# Altium project PCB_PROYECTO_2024.PrjPcb
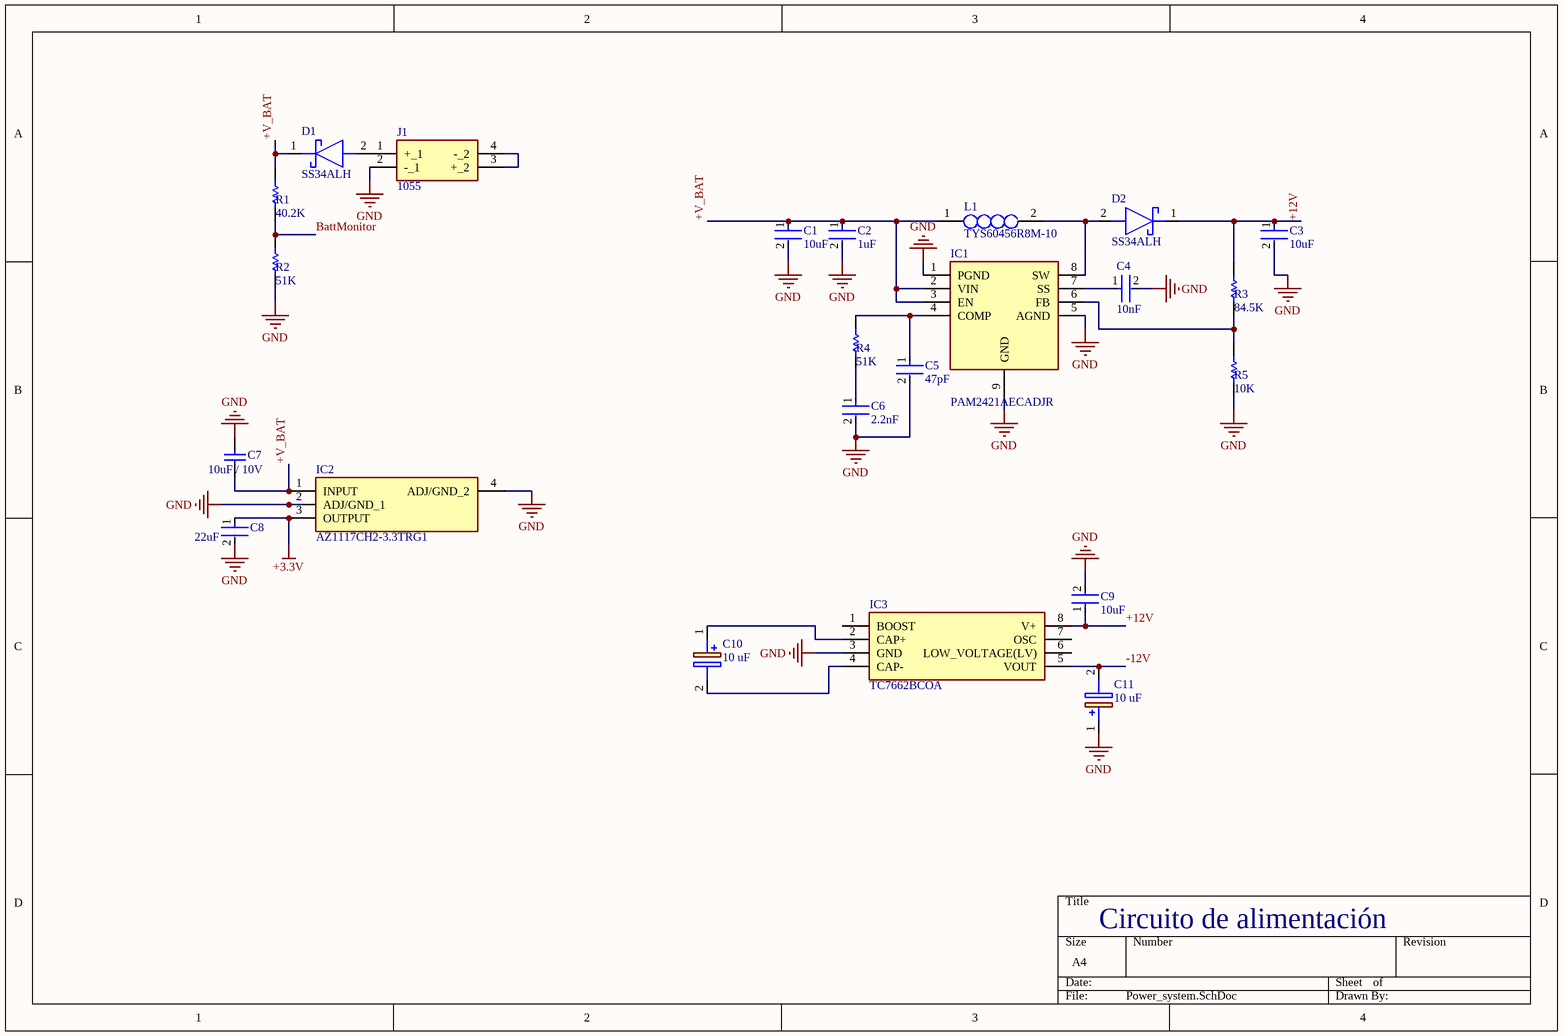
[diagram p0: Power_system.SchDoc]
3 sheets, 48 parts. Net scope: global (net labels, ports and power ports of the same name join across sheets).
Board file: PCB1.PcbDoc
Sheets:
  Power_system.SchDoc
  ESP32_SENSORS.SchDoc
  Signal_conditioning.SchDoc

## Sheet Power_system.SchDoc
size A4; SheetNumber: 1; SheetTotal: 3

### Parts
C1  10uF  [FP-GRM188-0_2-MFG]
C2  1uF  [FP-GRM188-0_2-MFG]
C3  10uF  [FP-GRM188-0_2-MFG]
C4  10nF  [FP-GRM188-0_2-MFG]
C5  47pF  [FP-GRM188-0_2-MFG]
C6  2.2nF  [FP-GRM188-0_2-MFG]
C7  10uF / 10V  [CAPC1608X90X35LL15T15]
C8  22uF  [FP-GRM188-0_2-MFG]
C9  10uF  [FP-GRM188-0_2-MFG]
C10  10 uF  [CAPAE430X550N]
C11  10 uF  [CAPAE430X550N]
D1  SS34ALH  [SODFL5226X100N]
D2  SS34ALH  [SODFL5226X100N]
IC1  PAM2421AECADJR  [SOIC127P600X150-9N]
IC2  AZ1117CH2-3.3TRG1  [SOT230P700X180-4N]
IC3  TC7662BCOA  [SOIC127P600X175-8N]
J1  1055  [1055]
L1  TYS60456R8M-10  [INDPM6060X470N]
R1  40.2K  [RESC1608X55X30ML20T20]
R2  51K  [RESC1608X55X30ML20T20]
R3  84.5K  [RESC1608X55X30ML20T20]
R4  51K  [RESC1608X55X30ML20T20]
R5  10K  [RESC1608X55X30ML20T20]

### Nets
+3.3V: C8.1 IC2.3(OUTPUT)
GND: C1.2 C2.2 C3.2 C4.2 C5.2 C6.2 C7.1 C8.2 C9.2 C11.1(+) IC1.1(PGND) IC1.5(AGND) IC1.9(GND) IC2.2(ADJ/GND_1) IC2.4(ADJ/GND_2) IC3.3(GND) J1.2(-_1) R2.1 R5.1
+12V: C3.1 C9.1 D2.1(K) IC3.8(V+) R3.2
+V_BAT: C1.1 C2.1 C7.2 D1.1(K) IC1.2(VIN) IC1.3(EN) IC2.1(INPUT) L1.1 R1.2
-12V: C11.2(-) IC3.5(VOUT)
BattMonitor: R1.1 R2.2
NetC4_1: C4.1 IC1.7(SS)
NetC5_1: C5.1 IC1.4(COMP) R4.2
NetC6_1: C6.1 R4.1
NetC10_1: C10.1(+) IC3.2(CAP+)
NetC10_2: C10.2(-) IC3.4(CAP-)
NetD1_2: D1.2(A) J1.1(+_1)
NetD2_2: D2.2(A) IC1.8(SW) L1.2
NetIC1_6: IC1.6(FB) R3.1 R5.2
NetJ1_3: J1.3(+_2) J1.4(-_2)

Not connected (* = marked no-connect by the designer): IC3 1(BOOST) 6(LOW_VOLTAGE(LV)) 7(OSC)

### Notes on the sheet
- Circuito de alimentación

### Library data of the parts
C1-C6 C8 C9 = CMP-2006-02788-2: Chip Multilayer Ceramic Capacitors for General Purpose, 0603, 22uF, X5R, 15%, 20%, 4V; Case/Package: 0603; Package Quantity: 4000; Lead Free: Lead Free; Material: Ceramic; Height: 0.8mm; Length: 1.6mm; REACH SVHC: No SVHC; Voltage Rating: 4V; Depth: 0.8mm; Case Code (Metric): 1608; Voltage: 4V; Dielectric: X5R; Width: 0.8mm; Max Operating Temperature: 85°C; Tolerance: 20%; Packaging: Tape and Reel; Case Code (Imperial): 0603; Voltage Rating (DC): 4V; Thickness: 0.035inch; Mount: Surface Mount; Min Operating Temperature: -55°C; Radiation Hardening: No; Capacitance: 22uF; Termination: SMD/SMT
C7 = CMP-2006-02241-1: Part Number: C0603C105K9PACTU; Manufacturer: Kemet
C10 C11 = 865080340001: Capacitor Polarised; Manufacturer_Name: Wurth Elektronik; Datasheet Link: https://componentsearchengine.com/Datasheets/1/865080340001.pdf; Height: 5.5mm; Manufacturer_Part_Number: 865080340001; Mouser Part Number: 710-865080340001; Mouser Price/Stock: https://www.mouser.co.uk/ProductDetail/Wurth-Elektronik/865080340001?qs=0KOYDY2FL2%252BaqRFD837lAw%3D%3D
D1 D2 = SS34ALH: Schottky Diode; Manufacturer_Name: Taiwan Semiconductor; Datasheet Link: https://services.ts.com.tw/storage/resources/datasheet/SS34ALH%20SERIES_B2103.pdf; Height: 1mm; Manufacturer_Part_Number: SS34ALH; Mouser Part Number: 821-SS34ALH; Mouser Price/Stock: https://www.mouser.co.uk/ProductDetail/Taiwan-Semiconductor/SS34ALH?qs=A6eO%252BMLsxmQip%2FrgNup6RA%3D%3D; Arrow Part Number: SS34ALH; Arrow Price/Stock: https://www.arrow.com/en/products/ss34alh/taiwan-semiconductor?region=nac
IC1 = PAM2421AECADJR: Integrated Circuit; Manufacturer_Name: Diodes Incorporated; Datasheet Link: https://www.diodes.com/assets/Datasheets/products_inactive_data/PAM2421_22_23.pdf; Height: 1.5mm; Manufacturer_Part_Number: PAM2421AECADJR; Mouser Part Number: 621-PAM2421AECADJR; Mouser Price/Stock: https://www.mouser.co.uk/ProductDetail/Diodes-Incorporated/PAM2421AECADJR?qs=pYVYkI7xuRVOhRU6vAk7Ag%3D%3D; Arrow Part Number: PAM2421AECADJR; Arrow Price/Stock: https://www.arrow.com/en/products/pam2421aecadjr/diodes-incorporated?region=nac
IC2 = AZ1117CH2-3.3TRG1: Integrated Circuit; Manufacturer_Name: Diodes Incorporated; Datasheet Link: https://www.arrow.com/en/products/az1117ch2-3.3trg1/diodes-incorporated; Height: 1.8mm; Manufacturer_Part_Number: AZ1117CH2-3.3TRG1; Mouser Part Number: 621-AZ1117CH2-33TRG1; Mouser Price/Stock: https://www.mouser.co.uk/ProductDetail/Diodes-Incorporated/AZ1117CH2-3.3TRG1?qs=lQAVKuKFhkLc7jCxso2G3w%3D%3D; Arrow Part Number: AZ1117CH2-3.3TRG1; Arrow Price/Stock: https://www.arrow.com/en/products/az1117ch2-3.3trg1/diodes-incorporated?region=nac
IC3 = TC7662BCOA: Integrated Circuit; Manufacturer_Name: Microchip; Datasheet Link: https://datasheet.datasheetarchive.com/originals/distributors/Datasheets-19/DSA-360076.pdf; Height: 1.75mm; Manufacturer_Part_Number: TC7662BCOA; Mouser Part Number: 579-TC7662BCOA; Mouser Price/Stock: https://www.mouser.co.uk/ProductDetail/Microchip-Technology/TC7662BCOA?qs=MvcPkWSywoxVMnnd8pEw8w%3D%3D; Arrow Part Number: TC7662BCOA; Arrow Price/Stock: https://www.arrow.com/en/products/tc7662bcoa/microchip-technology?region=nac
J1 = 1055: Connector; Manufacturer_Name: Keystone Electronics; Datasheet Link: https://www.keyelco.com/product-pdf.cfm?p=14065; Height: 15.48mm; Manufacturer_Part_Number: 1055; Mouser Part Number: 534-1055; Mouser Price/Stock: https://www.mouser.co.uk/ProductDetail/Keystone-Electronics/1055?qs=OkugU0Onrk3ye42txSrmZg%3D%3D
L1 = TYS60456R8M-10: Inductor; Manufacturer_Name: Laird Performance Materials; Datasheet Link: https://componentsearchengine.com/Datasheets/1/TYS60456R8M-10.pdf; Height: 4.7mm; Manufacturer_Part_Number: TYS60456R8M-10; Mouser Part Number: 875-TYS60456R8M-10; Mouser Price/Stock: https://www.mouser.co.uk/ProductDetail/Laird-Performance-Materials/TYS60456R8M-10?qs=HVbQlW5zcXUG%252BgroF%2F21Tw%3D%3D
R1-R5 = CMP-2000-00041-1: Part Number: ERA3AEB333V; Manufacturer: Panasonic

## Sheet ESP32_SENSORS.SchDoc
size A4; SheetNumber: 2; SheetTotal: 3
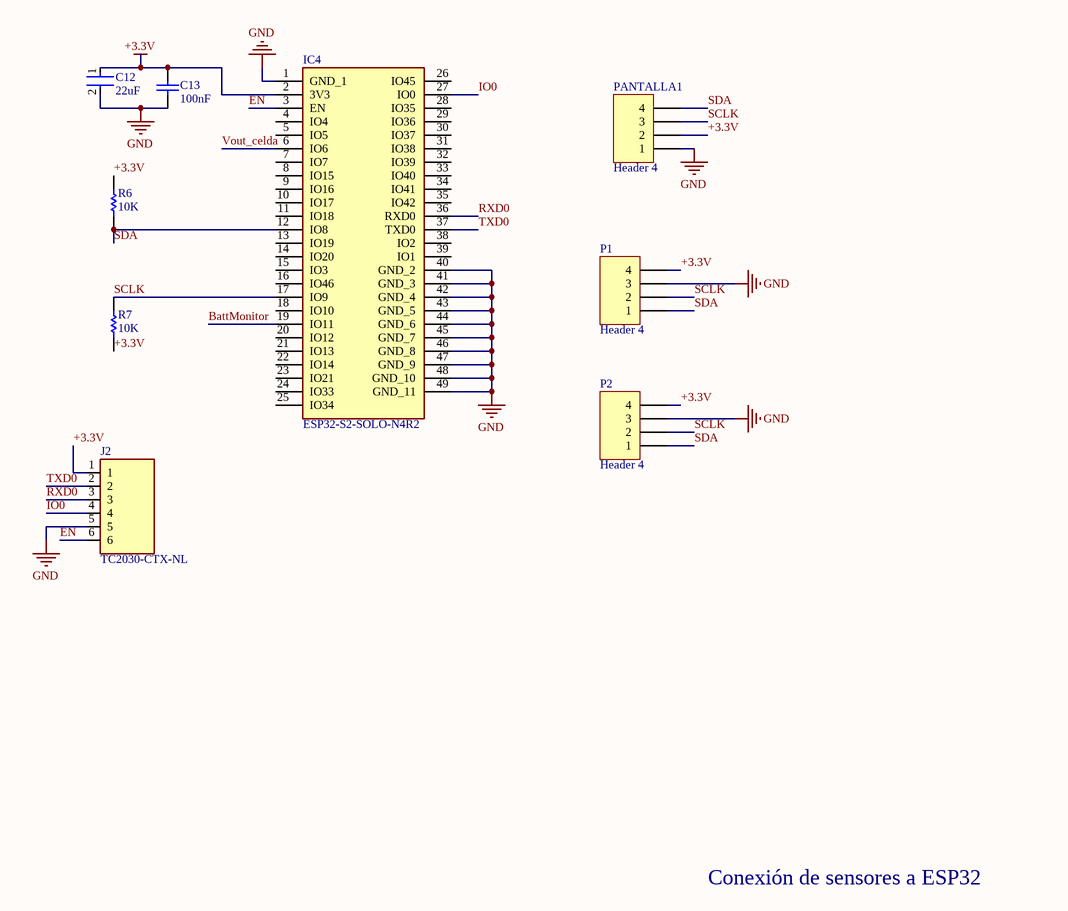
[diagram p1: ESP32_SENSORS.SchDoc]

### Parts
C12  22uF  [FP-GRM188-0_2-IPC_C]
C13  100nF  [CAPC1608X90X35NL10T15]
IC4  ESP32-S2-SOLO-N4R2  [ESP32S2SOLON4R2]
J2  TC2030-CTX-NL  [TC2030MCPNL10]
P1  Header 4  [HDR1X4]
P2  Header 4  [HDR1X4]
PANTALLA1  Header 4  [HDR1X4]
R6  10K  [RESC1609X55X30LL15T15]
R7  10K  [RESC1609X55X30LL15T15]

### Nets
+3.3V: C12.1 C13.2 IC4.2(3V3) J2.1 P1.4 P2.4 PANTALLA1.2 R6.1 R7.1
GND: C12.2 C13.1 IC4.1(GND_1) IC4.40(GND_2) IC4.41(GND_3) IC4.42(GND_4) IC4.43(GND_5) IC4.44(GND_6) IC4.45(GND_7) IC4.46(GND_8) IC4.47(GND_9) IC4.48(GND_10) IC4.49(GND_11) J2.5 P1.3 P2.3 PANTALLA1.1
BattMonitor: IC4.19(IO11)
EN: IC4.3(EN) J2.6
IO0: IC4.27(IO0) J2.4
RXD0: IC4.36(RXD0) J2.3
SCLK: IC4.17(IO9) P1.2 P2.2 PANTALLA1.3 R7.2
SDA: IC4.12(IO8) P1.1 P2.1 PANTALLA1.4 R6.2
TXD0: IC4.37(TXD0) J2.2
Vout_celda: IC4.6(IO6)

Not connected (* = marked no-connect by the designer): IC4 4(IO4) 5(IO5) 7(IO7) 8(IO15) 9(IO16) 10(IO17) 11(IO18) 13(IO19) 14(IO20) 15(IO3) 16(IO46) 18(IO10) 20(IO12) 21(IO13) 22(IO14) 23(IO21) 24(IO33) 25(IO34) 26(IO45) 28(IO35) 29(IO36) 30(IO37) 31(IO38) 32(IO39) 33(IO40) 34(IO41) 35(IO42) 38(IO2) 39(IO1)

### Notes on the sheet
- Conexión de sensores a ESP32

### Library data of the parts
C12 = CMP-2006-02545-2: Chip Multilayer Ceramic Capacitors for General Purpose, 0603, 4.7uF, X5R, 15%, 10%, 35V; Lead Free: Lead Free; Max Operating Temperature: 85°C; Case Code (Imperial): 0603; Capacitance: 4.7uF; Width: 0.8mm; Thickness: 0.031inch; Case Code (Metric): 1608; Min Operating Temperature: -55°C; Voltage Rating (DC): 35V; Dielectric: X5R; Voltage: 35V; Packaging: Tape and Reel; Resistor Type: Ceramic; Weight: 0.000222oz; Mount: Surface Mount; Material: Ceramic; Depth: 0.8mm; Tolerance: 10%; REACH SVHC: No SVHC; Case/Package: 0603; Voltage Rating: 35V; Package Quantity: 4000; Height: 0.8mm; Length: 1.6mm; Termination: SMD/SMT
C13 = CMP-2006-02777-1: Manufacturer: Murata; Part Number: GRM188F51E104ZA01D
IC4 = ESP32-S2-SOLO-N4R2: Integrated Circuit; Manufacturer_Name: Espressif Systems; Datasheet Link: https://www.espressif.com/sites/default/files/documentation/esp32-s2-solo_esp32-s2-solo-u_datasheet_en.pdf; Height: 3.25mm; Manufacturer_Part_Number: ESP32-S2-SOLO-N4R2; Mouser Part Number: 356-ESP32-S2SOLON4R2; Mouser Price/Stock: https://www.mouser.co.uk/ProductDetail/Espressif-Systems/ESP32-S2-SOLO-N4R2?qs=pBJMDPsKWf0j4qPDQHWJuA%3D%3D
J2 = TC2030-CTX-NL: Connector; Manufacturer: Tag Connect; Datasheet Link: http://www.tag-connect.com/Materials/TC2030-CTX.pdf; Height: 18mm; Manufacturer Product Number: TC2030-CTX-NL
P1 P2 PANTALLA1 = Header 4: Header, 4-Pin; LatestRevisionDate: 17-Jul-2002; LatestRevisionNote: Re-released for DXP Platform.; Publisher: Altium Limited
R6 R7 = CMP-1012-00623-3: Chip Resistor, 10 KOhm, +/- 1%, 0.1 W, -55 to 155 degC, 0603 (1608 Metric), RoHS, Tape and Reel; Manufacturer: Panasonic; Voltage Rating: 75V; Case\/Package: 0603; Power Rating: 100mW; Resistance: 10KOhm; Temperature Coefficient: 100ppm\/degreesC; Number of Pins: 2; Package Reference: 603; Depth: 0.8mm; Mount: SurfaceMount; Package Description: 2-Pin Surface Mount Device, Body 1.6 x 0.85 mm; Datasheet Version: 02/2017; Length: 1.6mm; Lead Free: LeadFree; Height: 0.45mm; Number of Terminations: 2; Max Power Dissipation: 100mW; Min Operating Temperature: -55degC; Datasheet URL: https://industrial.panasonic.com/cdbs/www-data/pdf/RDA0000/AOA0000C304.pdf; Termination: SMD/SMT; Case Code (Metric): 1608; Case Code (Imperial): 0603; Tolerance: 1%; Max Operating Temperature: 155degC; RoHSCompliant: true; Voltage Rating (DC): 75V; Radiation Hardening: No; Packaging: TapeandReel; Composition: ThickFilm; Mounting Technology: SurfaceMount; Manufacturer URL: http://www.panasonic.com/; Width: 0.031inch; REACH SVHC: NoSVHC; Contact Plating: Tin; Military Standard: Not; Package Quantity: 1

## Sheet Signal_conditioning.SchDoc
size A4; SheetNumber: 3; SheetTotal: 3
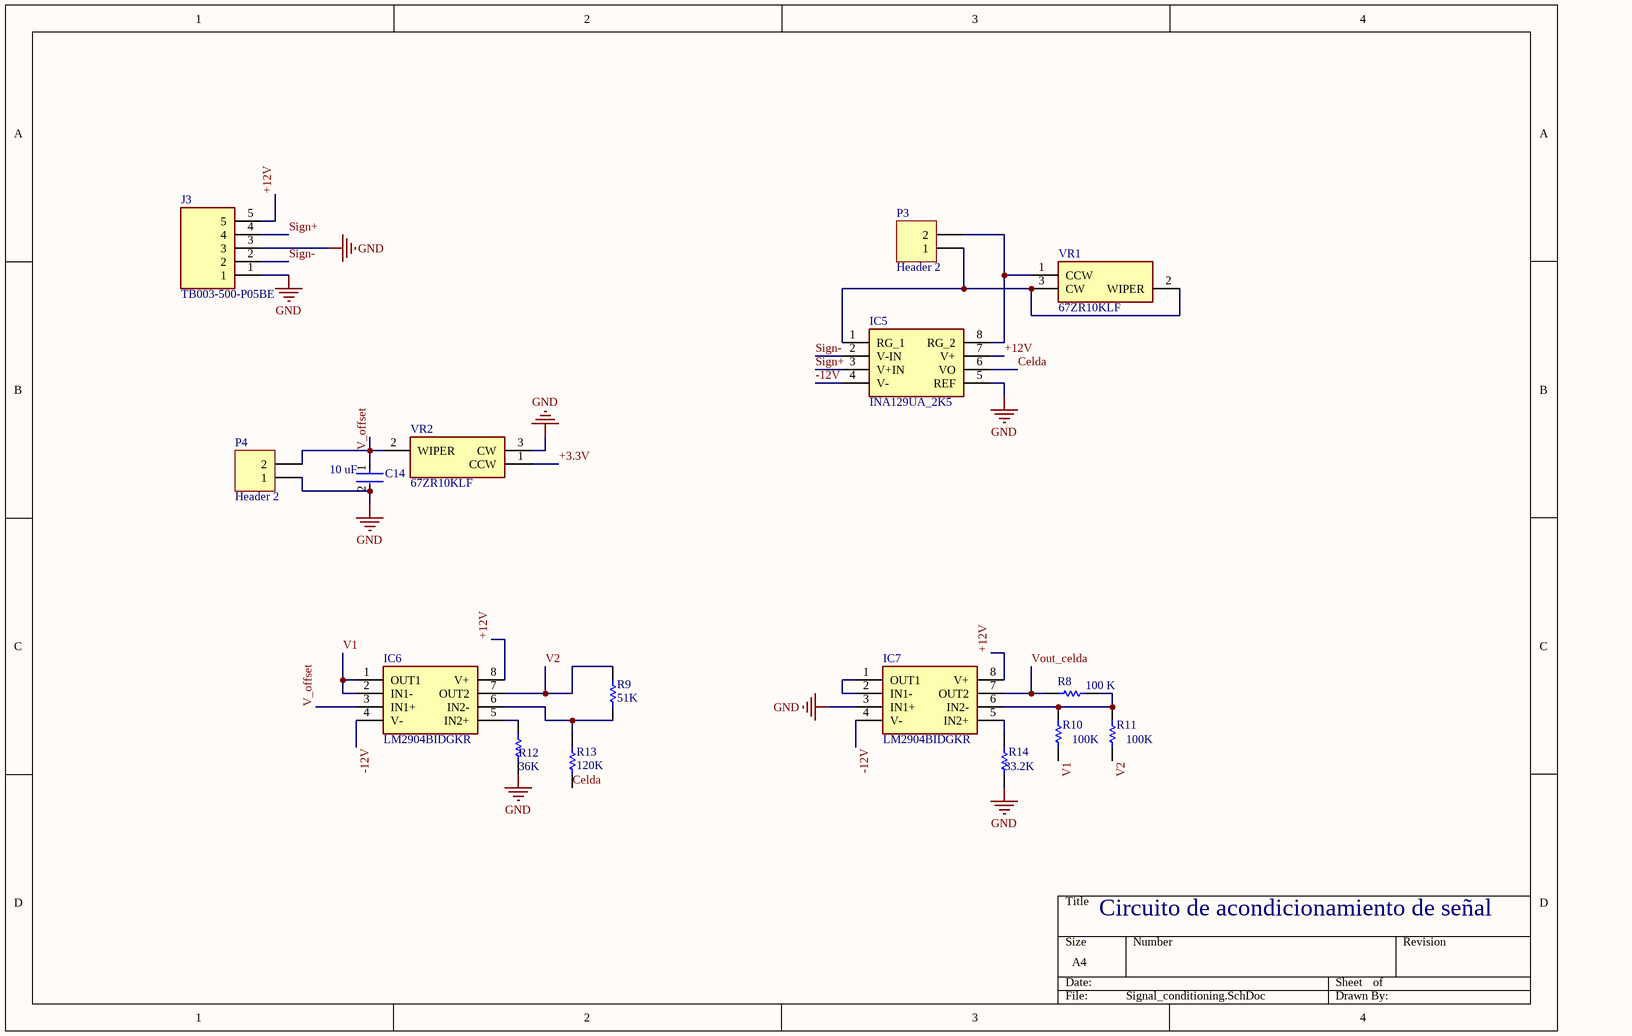
[diagram p2: Signal_conditioning.SchDoc]

### Parts
C14  10 uF  [FP-GRM188-0_1-e0_2_0_55-MFG]
IC5  INA129UA_2K5  [SOIC127P600X175-8N]
IC6  LM2904BIDGKR  [SOP65P490X110-8N]
IC7  LM2904BIDGKR  [SOP65P490X110-8N]
J3  TB003-500-P05BE  [TB003500P05BE]
P3  Header 2  [HDR1X2]
P4  Header 2  [HDR1X2]
R8  100 K  [RESC1608X55X30NL15T15]
R9  51K  [RESC1608X55X30ML20T20]
R10  100K  [RESC1608X55X30NL15T15]
R11  100K  [RESC1608X55X30NL15T15]
R12  36K  [RESC1608X55X30ML20T20]
R13  120K  [RESC1608X55X30ML20T20]
R14  33.2K  [RESC1608X55X30NL15T15]
VR1  67ZR10KLF  [67ZR10KLF]
VR2  67ZR10KLF  [67ZR10KLF]

### Nets
+3.3V: VR2.1(CCW)
GND: C14.2 IC5.5(REF) IC7.3(IN1+) J3.1 J3.3 P4.1 R12.1 R14.1 VR2.3(CW)
+12V: IC5.7(V+) IC6.8(V+) IC7.8(V+) J3.5
-12V: IC5.4(V-) IC6.4(V-) IC7.4(V-)
Celda: IC5.6(VO) R13.1
Sign+: IC5.3(V+IN) J3.4
Sign-: IC5.2(V-IN) J3.2
V1: IC6.1(OUT1) IC6.2(IN1-) R10.1
V2: IC6.7(OUT2) R9.2 R11.1
V_offset: C14.1 IC6.3(IN1+) P4.2 VR2.2(WIPER)
Vout_celda: IC7.7(OUT2) R8.2
NetIC5_1: IC5.1(RG_1) P3.1 VR1.2(WIPER) VR1.3(CW)
NetIC5_8: IC5.8(RG_2) P3.2 VR1.1(CCW)
NetIC6_5: IC6.5(IN2+) R12.2
NetIC6_6: IC6.6(IN2-) R9.1 R13.2
NetIC7_1: IC7.1(OUT1) IC7.2(IN1-)
NetIC7_5: IC7.5(IN2+) R14.2
NetIC7_6: IC7.6(IN2-) R8.1 R10.2 R11.2

### Notes on the sheet
- Circuito de acondicionamiento de señal

### Library data of the parts
C14 = CMP-2006-02759-2: Chip Multilayer Ceramic Capacitors for General Purpose, 0603, 10uF, X6S, 22%, 20%, 2.5V; Voltage Rating (DC): 2.5V; Package Quantity: 4000; Tolerance: 20%; Mount: Surface Mount; Height: 0.8mm; Voltage: 2.5V; Packaging: Tape and Reel; Thickness: 0.035inch; Case/Package: 0603; Max Operating Temperature: 105°C; Termination: SMD/SMT; Depth: 0.8mm; Case Code (Metric): 1608; Dielectric: X6S; Capacitance: 10uF; Voltage Rating: 2.5V; Width: 0.031inch; Radiation Hardening: No; Case Code (Imperial): 0603; REACH SVHC: No SVHC; Min Operating Temperature: -55°C; Length: 1.6mm
IC5 = INA129UA_2K5: Integrated Circuit; Manufacturer_Name: Texas Instruments; Manufacturer_Part_Number: INA129UA/2K5; Datasheet Link: http://www.ti.com/lit/gpn/INA129; Height: 1.75mm; Mouser Part Number: 595-INA129UA/2K5; Mouser Price/Stock: https://www.mouser.co.uk/ProductDetail/Texas-Instruments/INA129UA-2K5?qs=VBduBm9rCJTU2wXJjO5FZQ%3D%3D; Arrow Part Number: INA129UA/2K5; Arrow Price/Stock: https://www.arrow.com/en/products/ina129ua2k5/texas-instruments?region=nac
IC6 IC7 = LM2904BIDGKR: Integrated Circuit; Manufacturer_Name: Texas Instruments; Datasheet Link: https://pdf1.alldatasheet.com/ce52a4c4-aa79-4bf9-a931-b119e42401bc; Height: 1.1mm; Manufacturer_Part_Number: LM2904BIDGKR; Mouser Part Number: 595-LM2904BIDGKR; Mouser Price/Stock: https://www.mouser.co.uk/ProductDetail/Texas-Instruments/LM2904BIDGKR?qs=DRkmTr78QASPPFtqyAg2uA%3D%3D; Arrow Part Number: LM2904BIDGKR; Arrow Price/Stock: https://www.arrow.com/en/products/lm2904bidgkr/texas-instruments?region=nac
J3 = TB003-500-P05BE: Connector; Manufacturer_Name: CUI Devices; Datasheet Link: https://www.cui.com/product/resource/tb003-500.pdf; Height: 10.7mm; Manufacturer_Part_Number: TB003-500-P05BE; Mouser Part Number: 490-TB003-500-P05BE; Mouser Price/Stock: https://www.mouser.co.uk/ProductDetail/CUI-Devices/TB003-500-P05BE?qs=vLWxofP3U2xXm4XKOMROaw%3D%3D; Arrow Part Number: TB003-500-P05BE; Arrow Price/Stock: https://www.arrow.com/en/products/tb003-500-p05be/cui-devices?region=nac
P3 P4 = Header 2: Header, 2-Pin; LatestRevisionDate: 17-Jul-2002; LatestRevisionNote: Re-released for DXP Platform.; Publisher: Altium Limited
R8 R10 R11 R14 = CMP-2000-00705-1: Manufacturer: Panasonic; Part Number: ERJ-3GEYJ104V
R9 R12 R13 = CMP-2000-00041-1: as R1 on sheet Power_system
VR1 VR2 = 67ZR10KLF: Variable Resistor; Manufacturer_Name: TT Electronics; Datasheet Link: https://componentsearchengine.com/Datasheets/1/67ZR10KLF.pdf; Height: 10.4mm; Manufacturer_Part_Number: 67ZR10KLF; Mouser Part Number: 858-67ZR10KLF; Mouser Price/Stock: https://www.mouser.com/Search/Refine.aspx?Keyword=858-67ZR10KLF

## Nets that join several sheets
+3.3V: Power_system (C8.1 IC2.3), ESP32_SENSORS (9 pins), Signal_conditioning (VR2.1)
GND: Power_system (19 pins), ESP32_SENSORS (17 pins), Signal_conditioning (9 pins)
+12V: Power_system (5 pins), Signal_conditioning (IC5.7 IC6.8 IC7.8 J3.5)
-12V: Power_system (C11.2 IC3.5), Signal_conditioning (IC5.4 IC6.4 IC7.4)
BattMonitor: Power_system (R1.1 R2.2), ESP32_SENSORS (IC4.19)
Vout_celda: ESP32_SENSORS (IC4.6), Signal_conditioning (IC7.7 R8.2)